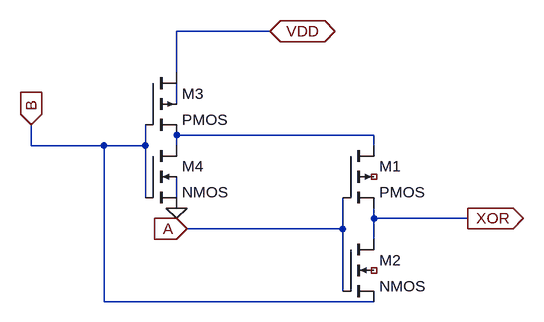
[diagram p0: schematic XOR_GDI_VDD.asc]
XOR_GDI_VDD.asc, the LTspice schematic file:
Version 4
SHEET 1 880 680
WIRE 144 -16 0 -16
WIRE 0 48 0 -16
WIRE 0 96 0 64
WIRE 304 144 0 144
WIRE -224 160 -224 128
WIRE -112 160 -224 160
WIRE -48 160 -48 128
WIRE -48 160 -112 160
WIRE 0 160 0 144
WIRE 304 160 304 144
WIRE -48 240 -48 160
WIRE 0 240 0 208
WIRE 304 272 304 256
WIRE 448 272 304 272
WIRE 256 288 256 240
WIRE 256 288 16 288
WIRE 304 304 304 272
WIRE 256 384 256 288
WIRE -112 400 -112 160
WIRE 304 400 -112 400
FLAG -224 128 B
IOPIN -224 128 In
FLAG 0 256 0
FLAG 16 288 A
IOPIN 16 288 In
FLAG 448 272 XOR
IOPIN 448 272 Out
FLAG 144 -16 VDD
IOPIN 144 -16 BiDir
SYMBOL pmos4 256 160 R0
SYMATTR InstName M1
SYMBOL nmos4 256 304 R0
SYMATTR InstName M2
SYMBOL pmos4 -48 48 R0
SYMATTR InstName M3
SYMBOL nmos4 -48 160 R0
SYMATTR InstName M4

The netlist it stands for:
* XOR_GDI_VDD.asc
M1 N002 A XOR NC_01 PMOS
M2 XOR A B NC_02 NMOS
M3 VDD B N002 N001 PMOS
M4 N002 B 0 N003 NMOS
.model NMOS NMOS
.model PMOS PMOS
.lib standard.mos
.backanno
.end